# Altium project PCB-Tester-Board-V1.PrjPcb (part 2 of 3)

## Sheet PSU2.SchDoc: PCB-Tester PSU2
size A3; Date: JUN 2020; CheckedBy: Moerz, Hoeren; Author: Rudziński; CompanyName: TDK-Micronas GmbH; DrawnBy: Rudziński; Engineer: Rudziński; Organization: Test Engineering; Address1: Hans-Bunte-Strasse 19; Address2: D-79108 Freiburg; Address3: Germany; DocumentNumber: U33110; Revision: V1.0; SheetNumber: 16; SheetTotal: 20; DateDraw: JUN 2020; DateChecked: 2020-06-19; PageSetup: Record=PageOptions|CenterHorizontal=True|CenterVertical=True|PrintScale=0.97|XCorrection=1.00|YCorrection=1.00|PrintKind=0|BorderSize=5000000|LeftOffset=0|BottomOffset=0|Orientation=2|PaperLength=1000|PaperWidth=1000|Scale=100|PaperSource=7|PrintQuality=-3|MediaType=1|DitherType=10|PrintScaleMode=1|PaperKind=A4|PaperIndex=9; TitleTyp: Title-Typ; Block: CPU & SCT8; Workspace: Workspace
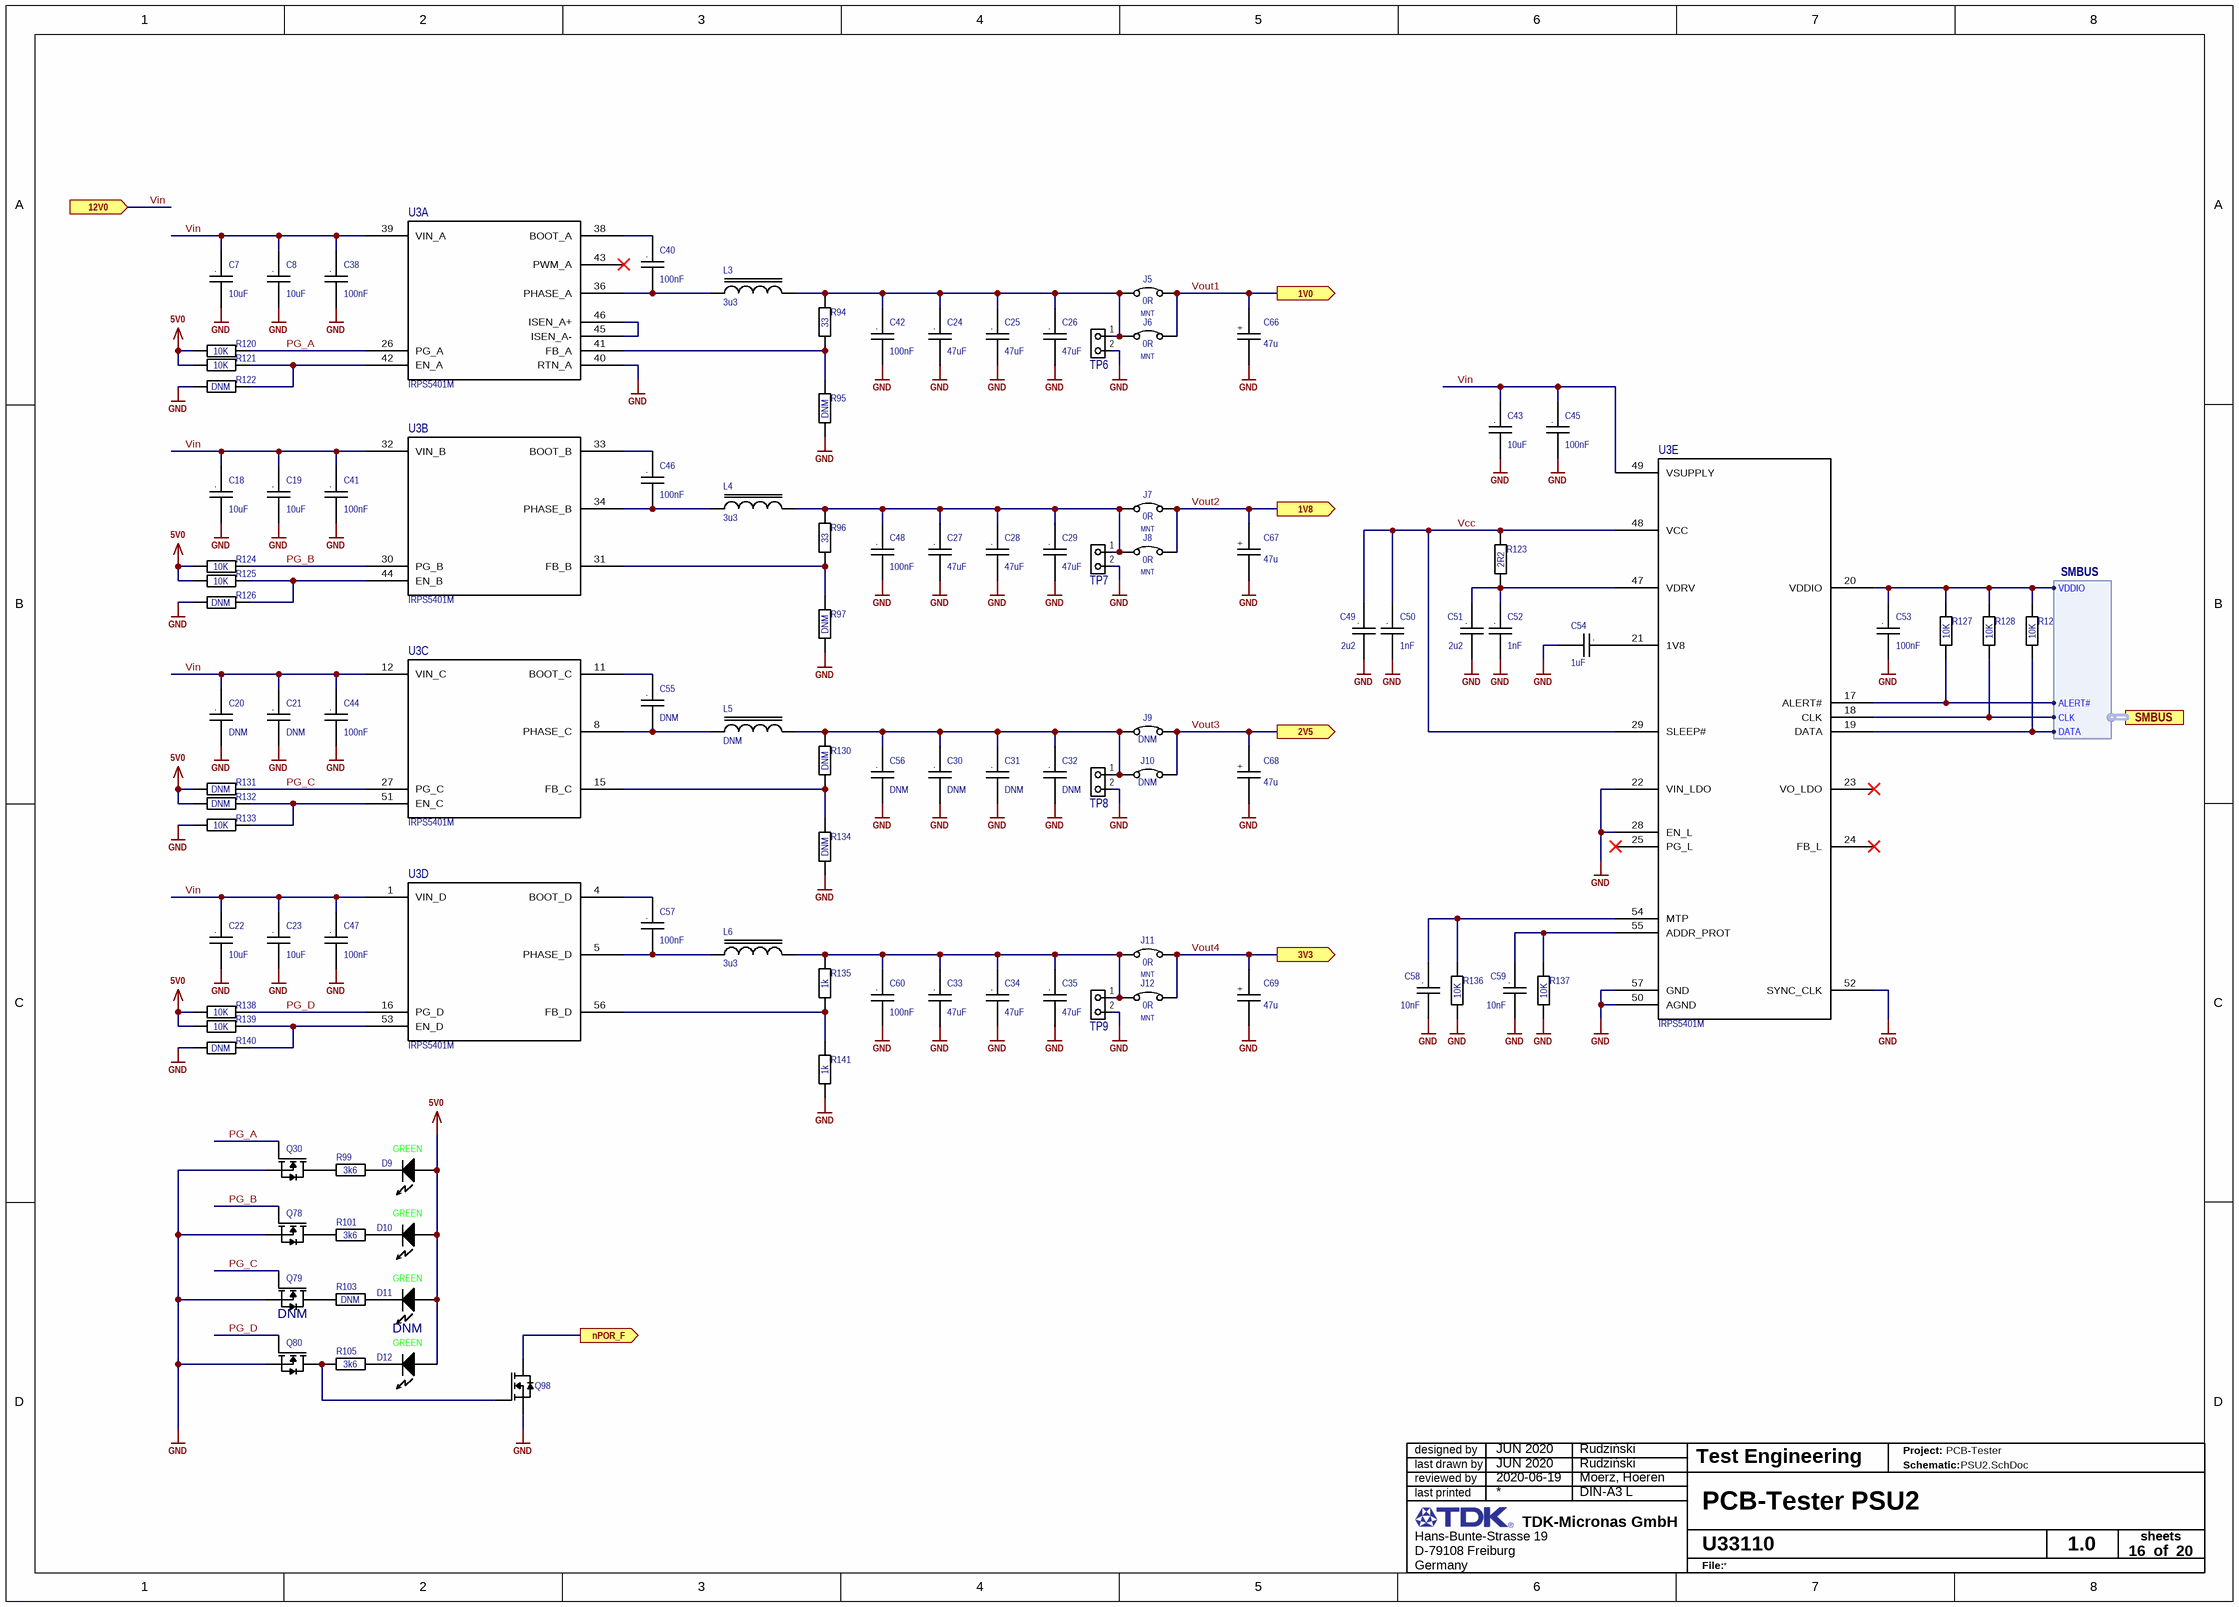
[diagram p3: PSU2.SchDoc]

### Parts
C7  value 10uF  [C1206 Reflow]  (hidden comment: C)
C8  value 10uF  [C1206 Reflow]  (hidden comment: C)
C18  value 10uF  [C1206 Reflow]  (hidden comment: C)
C19  value 10uF  [C1206 Reflow]  (hidden comment: C)
C20  value DNM  [C1206 Reflow]  (hidden comment: C)  (no BOM)
C21  value DNM  [C1206 Reflow]  (hidden comment: C)  (no BOM)
C22  value 10uF  [C1206 Reflow]  (hidden comment: C)
C23  value 10uF  [C1206 Reflow]  (hidden comment: C)
C24  value 47uF  [C1210 Reflow]  (hidden comment: C)
C25  value 47uF  [C1210 Reflow]  (hidden comment: C)
C26  value 47uF  [C1210 Reflow]  (hidden comment: C)
C27  value 47uF  [C1210 Reflow]  (hidden comment: C)
C28  value 47uF  [C1210 Reflow]  (hidden comment: C)
C29  value 47uF  [C1210 Reflow]  (hidden comment: C)
C30  value DNM  [C1210 Reflow]  (hidden comment: C)  (no BOM)
C31  value DNM  [C1210 Reflow]  (hidden comment: C)  (no BOM)
C32  value DNM  [C1210 Reflow]  (hidden comment: C)  (no BOM)
C33  value 47uF  [C1210 Reflow]  (hidden comment: C)
C34  value 47uF  [C1210 Reflow]  (hidden comment: C)
C35  value 47uF  [C1210 Reflow]  (hidden comment: C)
C38  value 100nF  [C0402 Reflow]  (hidden comment: C)
C40  value 100nF  [C0402 Reflow]  (hidden comment: C)
C41  value 100nF  [C0402 Reflow]  (hidden comment: C)
C42  value 100nF  [C0402 Reflow]  (hidden comment: C)
C43  value 10uF  [C1206 Reflow]  (hidden comment: C)
C44  value 100nF  [C0402 Reflow]  (hidden comment: C)
C45  value 100nF  [C0402 Reflow]  (hidden comment: C)
C46  value 100nF  [C0402 Reflow]  (hidden comment: C)
C47  value 100nF  [C0402 Reflow]  (hidden comment: C)
C48  value 100nF  [C0402 Reflow]  (hidden comment: C)
C49  value 2u2  [C0805 Reflow]  (hidden comment: C)
C50  value 1nF  [C0402 Reflow]  (hidden comment: C)
C51  value 2u2  [C0805 Reflow]  (hidden comment: C)
C52  value 1nF  [C0402 Reflow]  (hidden comment: C)
C53  value 100nF  [C0402 Reflow]  (hidden comment: C)
C54  value 1uF  [C0402 Reflow]  (hidden comment: C)
C55  value DNM  [C0402 Reflow]  (hidden comment: C)  (no BOM)
C56  value DNM  [C0402 Reflow]  (hidden comment: C)  (no BOM)
C57  value 100nF  [C0402 Reflow]  (hidden comment: C)
C58  value 10nF  [C0402 Reflow]  (hidden comment: C)
C59  value 10nF  [C0402 Reflow]  (hidden comment: C)
C60  value 100nF  [C0402 Reflow]  (hidden comment: C)
C66  value 47u  [CAP_TAN_B]  (hidden comment: C+)
C67  value 47u  [CAP_TAN_B]  (hidden comment: C+)
C68  value 47u  [CAP_TAN_B]  (hidden comment: C+)
C69  value 47u  [CAP_TAN_B]  (hidden comment: C+)
D9  Color: GREEN  [L0603G]  (hidden comment: D)
D10  Color: GREEN  [L0603G]  (hidden comment: D)
D11  Color: GREEN  NicName: DNM  [L0603G]  (hidden comment: D)  (no BOM)
D12  Color: GREEN  [L0603G]  (hidden comment: D)
J5  value 0R  POPULATED: MNT  [JumperSMD]  (hidden comment: J)  (no BOM)
J6  value 0R  POPULATED: MNT  [JumperSMD]  (hidden comment: J)  (no BOM)
J7  value 0R  POPULATED: MNT  [JumperSMD]  (hidden comment: J)  (no BOM)
J8  value 0R  POPULATED: MNT  [JumperSMD]  (hidden comment: J)  (no BOM)
J9  value DNM  [JumperSMD]  (hidden comment: J)  (no BOM)
J10  value DNM  [JumperSMD]  (hidden comment: J)  (no BOM)
J11  value 0R  POPULATED: MNT  [JumperSMD]  (hidden comment: J)  (no BOM)
J12  value 0R  POPULATED: MNT  [JumperSMD]  (hidden comment: J)  (no BOM)
L3  Inductance: 3u3  [XAL7070]  (hidden comment: L)
L4  Inductance: 3u3  [XAL7070]  (hidden comment: L)
L5  Inductance: DNM  [XAL7070]  (hidden comment: L)  (no BOM)
L6  Inductance: 3u3  [XAL7070]  (hidden comment: L)
Q30  Q  [SOT23-3]  (value not drawn)
Q78  Q  [SOT23-3]  (value not drawn)
Q79  NicName: DNM  [SOT23-3]  (hidden comment: Q)  (no BOM)
Q80  Q  [SOT23-3]  (value not drawn)
Q98  Q  [SOT23-3]  (value not drawn)
R94  value 33  [R0402 Reflow]  (hidden comment: R)
R95  value DNM  [R0402 Reflow]  (hidden comment: R)  (no BOM)
R96  value 33  [R0402 Reflow]  (hidden comment: R)
R97  value DNM  [R0402 Reflow]  (hidden comment: R)  (no BOM)
R99  value 3k6  [R0603 Reflow]  (hidden comment: R)
R101  value 3k6  [R0603 Reflow]  (hidden comment: R)
R103  value DNM  [R0603 Reflow]  (hidden comment: R)  (no BOM)
R105  value 3k6  [R0603 Reflow]  (hidden comment: R)
R120  value 10K  [R0402 Reflow]  (hidden comment: R)
R121  value 10K  [R0402 Reflow]  (hidden comment: R)
R122  value DNM  [R0402 Reflow]  (hidden comment: R)  (no BOM)
R123  value 2R2  [R0402 Reflow]  (hidden comment: R)
R124  value 10K  [R0402 Reflow]  (hidden comment: R)
R125  value 10K  [R0402 Reflow]  (hidden comment: R)
R126  value DNM  [R0402 Reflow]  (hidden comment: R)  (no BOM)
R127  value 10K  [R0402 Reflow]  (hidden comment: R)
R128  value 10K  [R0402 Reflow]  (hidden comment: R)
R129  value 10K  [R0402 Reflow]  (hidden comment: R)
R130  value DNM  [R0402 Reflow]  (hidden comment: R)  (no BOM)
R131  value DNM  [R0402 Reflow]  (hidden comment: R)  (no BOM)
R132  value DNM  [R0402 Reflow]  (hidden comment: R)  (no BOM)
R133  value 10K  [R0402 Reflow]  (hidden comment: R)
R134  value DNM  [R0402 Reflow]  (hidden comment: R)  (no BOM)
R135  value 1k  [R0402 Reflow]  (hidden comment: R)
R136  value 10K  [R0402 Reflow]  (hidden comment: R)
R137  value 10K  [R0402 Reflow]  (hidden comment: R)
R138  value 10K  [R0402 Reflow]  (hidden comment: R)
R139  value 10K  [R0402 Reflow]  (hidden comment: R)
R140  value DNM  [R0402 Reflow]  (hidden comment: R)  (no BOM)
R141  value 1k  [R0402 Reflow]  (hidden comment: R)
TP6  TP  [DualTestpoint 100mils]  (value not drawn)  (no BOM)
TP7  TP  [DualTestpoint 100mils]  (value not drawn)  (no BOM)
TP8  TP  [DualTestpoint 100mils]  (value not drawn)  (no BOM)
TP9  TP  [DualTestpoint 100mils]  (value not drawn)  (no BOM)
U3  IRPS5401M  [QFN4-7x7-56_IRPS5401M]  (parts A,B,C,D,E of 5)

### Ports
1V0 (out), 1V8 (out), 2V5 (out), 3V3 (out), 12V0 (in), nPOR_F (out), SMBUS (harness SMBUS)

### Harnesses
SMBUS: ALERT#, CLK, DATA, VDDIO

### Nets
5V0: D9.1(Anode) D10.1(Anode) D11.1(Anode) D12.1(Anode) R120.2 R121.2 R124.2 R125.2 R131.2 R132.2 R138.2 R139.2
GND: C7.2 C8.2 C18.2 C19.2 C20.2 C21.2 C22.2 C23.2 C24.2 C25.2 C26.2 C27.2 C28.2 C29.2 C30.2 C31.2 C32.2 C33.2 C34.2 C35.2 C38.2 C41.2 C42.2 C43.2 C44.2 C45.2 C47.2 C48.2 C49.2 C50.2 C51.2 C52.2 C53.2 C54.2 C56.2 C58.2 C59.2 C60.2 C66.2 C67.2 C68.2 C69.2 Q30.2(S) Q78.2(S) Q79.2(S) Q80.2(S) Q98.2(S) R95.1 R97.1 R122.2 R126.2 R133.2 R134.1 R136.1 R137.1 R140.2 R141.1 TP6.2 TP7.2 TP8.2 TP9.2 U3.22(VIN_LDO) U3.28(EN_L) U3.40(RTN_A) U3.50(AGND) U3.52(SYNC_CLK) U3.57(GND)
nPOR_F: Q98.3(D) ; port nPOR_F
PG_A: Q30.1(G) R120.1 U3.26(PG_A)  [project net PG_A_16]
PG_B: Q78.1(G) R124.1 U3.30(PG_B)  [project net PG_B_16]
PG_C: Q79.1(G) R131.1 U3.27(PG_C)  [project net PG_C_16]
PG_D: Q80.1(G) R138.1 U3.16(PG_D)  [project net PG_D_16]
Vcc: C49.1 C50.1 R123.2 U3.29(SLEEP#) U3.48(VCC)  [project net Vcc_16]
Vin: C7.1 C8.1 C18.1 C19.1 C20.1 C21.1 C22.1 C23.1 C38.1 C41.1 C43.1 C44.1 C45.1 C47.1 U3.1(VIN_D) U3.12(VIN_C) U3.32(VIN_B) U3.39(VIN_A) U3.49(VSUPPLY) ; port 12V0
Vout1: C66.1 J5.2 J6.2 ; port 1V0
Vout2: C67.1 J7.2 J8.2 ; port 1V8
Vout3: C68.1 J9.2 J10.2 ; port 2V5
Vout4: C69.1 J11.2 J12.2 ; port 3V3
NetC24_1: C24.1 C25.1 C26.1 C42.1 J5.1 J6.1 L3.2 R94.2 TP6.1
NetC27_1: C27.1 C28.1 C29.1 C48.1 J7.1 J8.1 L4.2 R96.2 TP7.1
NetC30_1: C30.1 C31.1 C32.1 C56.1 J9.1 J10.1 L5.2 R130.2 TP8.1
NetC33_1: C33.1 C34.1 C35.1 C60.1 J11.1 J12.1 L6.2 R135.2 TP9.1
NetC40_1: C40.1 U3.38(BOOT_A)
NetC40_2: C40.2 L3.1 U3.36(PHASE_A)
NetC46_1: C46.1 U3.33(BOOT_B)
NetC46_2: C46.2 L4.1 U3.34(PHASE_B)
NetC51_1: C51.1 C52.1 R123.1 U3.47(VDRV)
NetC53_1: C53.1 R127.2 R128.2 R129.2 U3.20(VDDIO) ; port SMBUS.VDDIO
NetC54_1: C54.1 U3.21(1V8)
NetC55_1: C55.1 U3.11(BOOT_C)
NetC55_2: C55.2 L5.1 U3.8(PHASE_C)
NetC57_1: C57.1 U3.4(BOOT_D)
NetC57_2: C57.2 L6.1 U3.5(PHASE_D)
NetC58_1: C58.1 R136.2 U3.54(MTP)
NetC59_1: C59.1 R137.2 U3.55(ADDR_PROT)
NetD9_2: D9.2(Cathode) R99.2
NetD10_2: D10.2(Cathode) R101.2
NetD11_2: D11.2(Cathode) R103.2
NetD12_2: D12.2(Cathode) R105.2
NetQ30_3: Q30.3(D) R99.1
NetQ78_3: Q78.3(D) R101.1
NetQ79_3: Q79.3(D) R103.1
NetQ80_3: Q80.3(D) Q98.1(G) R105.1
NetR94_1: R94.1 R95.2 U3.41(FB_A)
NetR96_1: R96.1 R97.2 U3.31(FB_B)
NetR121_1: R121.1 R122.1 U3.42(EN_A)
NetR125_1: R125.1 R126.1 U3.44(EN_B)
NetR127_1: R127.1 U3.17(ALERT#) ; port SMBUS.ALERT#
NetR128_1: R128.1 U3.18(CLK) ; port SMBUS.CLK
NetR129_1: R129.1 U3.19(DATA) ; port SMBUS.DATA
NetR130_1: R130.1 R134.2 U3.15(FB_C)
NetR132_1: R132.1 R133.1 U3.51(EN_C)
NetR135_1: R135.1 R141.2 U3.56(FB_D)
NetR139_1: R139.1 R140.1 U3.53(EN_D)
NetU3_45: U3.45(ISEN_A-) U3.46(ISEN_A+)

Not connected (* = marked no-connect by the designer): U3 23(VO_LDO)* 24(FB_L)* 25(PG_L)* 43(PWM_A)*

### Notes on the sheet
- designed by
- reviewed by
- last drawn by
- Project:
- Schematic:
- last printed
- DIN-A3 L
- sheets
- of
- File:
- (in symbol C) .
- (in symbol C+_TAN) +
- (in symbol C_2) .
- (in symbol C_7) .
- (in symbol C_10) .
- (in symbol C_11) .

### Library data of the parts
C7 C8 C18-C23 C43 = C: CAP CER 10UF 25V X7R 1206; 04. Manufacturer: TDK Corporation; 07. Manufacturer  Part Number: C3216X7R1E106K160AB; Tolerance: ±10%; 03. Unit Price: 0.66; 13. Created Date/Name: AUG2018/Hören; Voltage Rating: 25V; Type: X7R; ComponentLink1Description: Info; ComponentLink1URL: https://www.digikey.de/products/en?keywords=445-7705-6-ND; 02. Distributor Part Number: 445-7705-6-ND; 09. Operating Temperature: -55°C ~ 125°C; 11. RoHS: YES; 01. Distributor: DigiKey; ComponentLink2Description: DataSheet; Package: 1206
C24-C35 = C: CAP CER 47UF 10V X5R 1210; 04. Manufacturer: Samsung Electro-Mechanics; 07. Manufacturer  Part Number: CL32A476MPJNNNE; Tolerance: ±20%; 03. Unit Price: 0.88; 13. Created Date/Name: AUG2018/Hören; Voltage Rating: 10V; Type: X5R; ComponentLink1Description: Info; ComponentLink1URL: *; 02. Distributor Part Number: 1276-3380-6-ND; 09. Operating Temperature: -55°C ~ 85°C; 11. RoHS: YES; 01. Distributor: DigiKey; ComponentLink2Description: DataSheet; Package: 1210
C38 C40-C42 C44-C48 C53 C55-C57 C60 = C: CAP CER 0.1UF 25V X7R 0402; 04. Manufacturer: Yageo; 07. Manufacturer  Part Number: CC0402KRX7R8BB104; Tolerance: ±10%; 03. Unit Price: 0.09; 13. Created Date/Name: AUG2018/Hören; Voltage Rating: 25V; Type: X7R; ComponentLink1Description: Info; ComponentLink1URL: https://www.digikey.de/products/en?keywords=311-2077-6-ND; 02. Distributor Part Number: 311-2077-6-ND; 09. Operating Temperature: -55°C ~ 125°C; 11. RoHS: YES; 01. Distributor: DigiKey; ComponentLink2Description: DataSheet; Package: 0402
C49 C51 = C_11: CAP CER 2.2UF 10V X7R 0805; 04. Manufacturer: Samsung Electro-Mechanics; 07. Manufacturer  Part Number: CL21B225KPFNNNE; 03. Unit Price: 0.11; Voltage Rating: 10V; Type: X7R; ComponentLink1Description: Info; ComponentLink1URL: https://www.digikey.de/products/en?keywords=311-2077-6-ND; 02. Distributor Part Number: 1276-1188-1-ND; 11. RoHS: YES; 01. Distributor: DigiKey; ComponentLink2Description: DataSheet; Package: 0805
C50 C52 = C_7: CAP CER 1000PF 25V X7R 0402; 04. Manufacturer: KEMET; 07. Manufacturer  Part Number: C0402C102K3RACTU; Tolerance: ±10%; 03. Unit Price: 0.09; 13. Created Date/Name: AUG2018/Hören; Voltage Rating: 25V; Type: X7R; ComponentLink1Description: Info; ComponentLink1URL: https://www.digikey.de/products/en?keywords=399-1031-6-ND; 02. Distributor Part Number: 399-1031-6-ND; 09. Operating Temperature: -55°C ~ 125°C; 11. RoHS: YES; 01. Distributor: DigiKey; ComponentLink2Description: DataSheet; Package: 0402
C54 = C_2: CAP CER 1UF 6.3V X7R 0402; 04. Manufacturer: Murata Electronics; 07. Manufacturer  Part Number: GRM155R70J105KA12J; Tolerance: ±10%; 03. Unit Price: 0.11; 13. Created Date/Name: AUG2018/Hören; Voltage Rating: 6.3V; Type: X7R; ComponentLink1Description: Info; ComponentLink1URL: https://www.digikey.de/product-detail/en/murata-electronics/GRM155R70J105KA12J/490-13339-6-ND/5973468; 02. Distributor Part Number: 490-13339-6-ND; 09. Operating Temperature: -55°C ~ 125°C; 11. RoHS: YES; 01. Distributor: DigiKey; ComponentLink2Description: DataSheet; Package: 0402
C58 C59 = C_10: CAP CER 0.01UF 25V X7R 0402; 04. Manufacturer: Murata Electronics; 07. Manufacturer  Part Number: GCM155R71E103KA37D; Tolerance: ±10%; 03. Unit Price: 0.09; Voltage Rating: 25V; Type: X7R; ComponentLink1Description: Info; 02. Distributor Part Number: 490-6043-1-ND; 09. Operating Temperature: -55°C ~ 125°C; 11. RoHS: YES; 01. Distributor: DigiKey; ComponentLink2Description: DataSheet; ComponentLink2URL: https://www.murata.com/~/media/webrenewal/support/library/catalog/products/capacitor/mlcc/c03e.ashx?la=en-us; Package: 0402
  C58: ComponentLink1URL: https://www.digikey.de/products/en?keywords=311-2077-6-ND
  C59: ComponentLink1URL: https://www.digikey.de/product-detail/en/murata-electronics/GCM155R71E103KA37D/490-6043-1-ND/3845243
C66-C69 = C+_TAN: CAP TANT 47UF 20% 10V 1411; 04. Manufacturer: AVX Corporation; 07. Manufacturer  Part Number: F971A476MBAHT3; 03. Unit Price: 0.73; 3D-Export: No; ComponentLink1Description: Info; 02. Distributor Part Number: 478-12531-1-ND; 11. RoHS: YES; 01. Distributor: DigiKey; ComponentLink2Description: DataSheet
D9-D12 = LED: LED GREEN DIFFUSED 0603 SMD; 04. Manufacturer: OSRAM Opto Semiconductors Inc.; 07. Manufacturer  Part Number: LG L29K-G2J1-24-Z; Vf: 1.7V; If: 2mA; Wave Length: 570nm; Viewing Angle: 160°; 03. Unit Price: 0.4; 13. Created Date/Name: AUG2018/Hören; ComponentLink1Description: Info; ComponentLink1URL: https://www.digikey.de/products/en?keywords=475-2709-6-ND; ComponentLink2Description: DataSheet; ComponentLink2URL: https://www.digikey.de/products/en?keywords=475-2709-6-ND; 02. Distributor Part Number: 475-2709-6-ND; 11. RoHS: YES; 01. Distributor: DigiKey
J5-J12 = Jumper SMD: RES SMD 0 OHM JUMPER 1/10W 0603; 04. Manufacturer: Yageo; 07. Manufacturer  Part Number: RC0603JR-070RL; 03. Unit Price: 0.09; 01. Distributor: DigiKey; 02. Distributor Part Number: 311-0.0GRDKR-ND; 09. Operating Temperature: -55°C ~ 155°C; 11. RoHS: YES; Package: 0603; ComponentLink4Description: Info; ComponentLink4URL: https://www.digikey.de/product-detail/en/yageo/RC0603JR-070RL/311-0.0GRDKR-ND/732569; ComponentLink5Description: DataSheet; ComponentLink5URL: http://www.yageo.com/documents/recent/PYu-RC_Group_51_RoHS_L_10.pdf
L3-L6 = INDUCTOR: Fixed Inductors 3.3uH Shld 20% 15.1A 9.42mOhms AECQ2; 04. Manufacturer: Coilcraft; 07. Manufacturer  Part Number: XAL7070-332MEC; Impedance Tolerance: %; 03. Unit Price: 3.05; ComponentLink1Description: Info; ComponentLink1URL: https://www.digikey.de/products/en?keywords=732-1620-6-ND; ComponentLink2Description: DataSheet; ComponentLink2URL: https://www.we-online.de/katalog/datasheet/742792040.pdf; 02. Distributor Part Number: 994-XAL7070-332MEC; 11. RoHS: YES; Tolerance: *; Value: *; 01. Distributor: Mouser
Q30 Q78-Q80 Q98 = FDV303N: MOSFET N-CH 25V 680MA SOT-23; 04. Manufacturer: ON Semiconductor; 03. Unit Price: 0.41; 13. Created Date/Name: AUG 2018 / Hören; Rds On: 450 mΩ @ id=500mA & Vgs=4.5V; Vgs,th: 1.5V @ 250uA; Power Rating: 350mW; 3D-Export: No; 01. Distributor: DigiKey; 02. Distributor Part Number: FDV303NDKR-ND; 07. Manufacturer  Part Number: FDV303N; 09. Operating Temperature: -55°C ~ 150°C (TJ); 11. RoHS: YES; ComponentLink1Description: Info; ComponentLink1URL: https://www.digikey.de/product-detail/en/on-semiconductor/FDV303N/FDV303NDKR-ND/1630434; ComponentLink2Description: DataSheet; ComponentLink2URL: https://media.digikey.com/pdf/Data%20Sheets/Fairchild%20PDFs/FDV303N.pdf; Vdss: 25V; Id: 680mA
R94 R96 = R: RES SMD 33 OHM 1% 1/16W 0402; 04. Manufacturer: Yageo; 07. Manufacturer  Part Number: RC0402FR-0733RL; 03. Unit Price: 0.09; 13. Created Date/Name: AUG2018/Hören; Power Rating: 63mW; Tolerance: ±1%; ComponentLink1URL: https://www.digikey.de/products/en?keywords=311-10.0KLRDKR-ND; ComponentLink1Description: Info; 02. Distributor Part Number: 311-33.0LRDKR-ND; 09. Operating Temperature: -55°C ~ 155°C; 11. RoHS: YES; 01. Distributor: DigiKey; ComponentLink2Description: DataSheet; Type: Thick Film; Package: 0402
R95 R97 R120-R122 R124-R134 R136-R140 = R: RES SMD 10K OHM 1% 1/16W 0402; 04. Manufacturer: Yageo; 07. Manufacturer  Part Number: RC0402FR-0710KL; 03. Unit Price: 0.09; 13. Created Date/Name: AUG2018/Hören; Power Rating: 63mW; Tolerance: ±1%; ComponentLink1URL: https://www.digikey.de/products/en?keywords=311-10.0KLRDKR-ND; ComponentLink1Description: Info; 02. Distributor Part Number: 311-10.0KLRDKR-ND; 09. Operating Temperature: -55°C ~ 155°C; 11. RoHS: YES; 01. Distributor: DigiKey; ComponentLink2Description: DataSheet; Type: Thick Film; Package: 0402
R99 R101 R105 = R: RES SMD 3.6K OHM 1% 1/10W 0603; 04. Manufacturer: Yageo; 07. Manufacturer  Part Number: RC0603FR-073K6L; 03. Unit Price: 0.09; 13. Created Date/Name: AUG2018/Hören; Power Rating: 63mW; Tolerance: ±1%; ComponentLink1URL: https://www.digikey.de/product-detail/en/yageo/RC0402FR-071K65L/YAG3043DKR-ND/5282914; ComponentLink1Description: Info; 02. Distributor Part Number: 311-3.60KHRCT-ND; 09. Operating Temperature: -55°C ~ 155°C; 11. RoHS: YES; 01. Distributor: DigiKey; ComponentLink2Description: DataSheet; Type: Thick Film; Package: 0402
R103 = R: RES SMD 1.65K OHM 1% 1/16W 0402; 04. Manufacturer: Yageo; 07. Manufacturer  Part Number: RC0402FR-071K65L; 03. Unit Price: 0.09; 13. Created Date/Name: AUG2018/Hören; Power Rating: 63mW; Tolerance: ±1%; ComponentLink1URL: https://www.digikey.de/product-detail/en/yageo/RC0402FR-071K65L/YAG3043DKR-ND/5282914; ComponentLink1Description: Info; 02. Distributor Part Number: YAG3043DKR-ND; 09. Operating Temperature: -55°C ~ 155°C; 11. RoHS: YES; 01. Distributor: DigiKey; ComponentLink2Description: DataSheet; Type: Thick Film; Package: 0402
R123 = R_24: RES SMD 2.2 OHM 1% 1/16W 0402; 04. Manufacturer: Yageo; 07. Manufacturer  Part Number: RC0402FR-072R2L; 03. Unit Price: 0.09; Power Rating: 0.1W; Tolerance: ±1%; ComponentLink1URL: https://www.digikey.de/product-detail/en/panasonic-electronic-components/ERJ-2RKF15R0X/P15.0LDKR-ND/575530; ComponentLink1Description: Info; 02. Distributor Part Number: 311-2.20LRTR-ND; 11. RoHS: YES; ComponentLink2Description: DataSheet; ComponentLink2URL: https://industrial.panasonic.com/cdbs/www-data/pdf/RDA0000/AOA0000C304.pdf; Package: 0402
R135 R141 = R: RES SMD 1K OHM 1% 1/16W 0402; 04. Manufacturer: Yageo; 07. Manufacturer  Part Number: RC0402FR-071KP; 03. Unit Price: 0.09; 13. Created Date/Name: AUG2018/Hören; Power Rating: 63mW; Tolerance: ±1%; ComponentLink1URL: https://www.digikey.de/products/en?keywords=311-10.0KLRDKR-ND; ComponentLink1Description: Info; 02. Distributor Part Number: YAG1254CT-ND; 09. Operating Temperature: -55°C ~ 155°C; 11. RoHS: YES; 01. Distributor: DigiKey; ComponentLink2Description: DataSheet; Type: Thick Film; Package: 0402
TP6-TP9 = DualTestpoint 100mils: Dual testpoint, pitch 2.54mm; 04. Manufacturer: Samtec Inc.; 07. Manufacturer  Part Number: HMTSW-103-07-G-S-240; 03. Unit Price: 0.25; 13. Created Date/Name: AUG2018/Hören; 01. Distributor: Samtec Inc.; 02. Distributor Part Number: HMTSW-103-07-G-S-240; 11. RoHS: YES; ComponentLink1Description: Info; ComponentLink1URL: https://www.samtec.com/products/hmtsw-103-07-g-s-240; ComponentLink2Description: DataSheet; ComponentLink2URL: http://suddendocs.samtec.com/catalog_english/hmtsw.pdf
U3 = IRPS5401M: POL - SUPIRBUCK; MFR-PN: IRPS5401MTRPBF; MFR: Infineon; 04. Manufacturer: Infineon Technologies; 03. Unit Price: 6.99; 07. Manufacturer  Part Number: IRPS5401MTRPBF; 01. Distributor: DigiKey; 02. Distributor Part Number: IRPS5401MTRPBFCT-ND; 11. RoHS: YES; ComponentLink4Description: Info; ComponentLink4URL: https://www.digikey.de/products/en?keywords=XC7A15T-1CSG324C; ComponentLink5Description: DataSheet; ComponentLink5URL: https://www.xilinx.com/support/documentation/data_sheets/ds181_Artix_7_Data_Sheet.pdf; ComponentLink6Description: NXP; ComponentLink6URL: https://www.nxp.com/part/MK20DN512VMD10; NicName: IRPS5401M

## Sheet PSU3.SchDoc: PCB-Tester PSU3
size A4; Date: JUN 2020; CheckedBy: Moerz, Hoeren; Author: Rudziński; CompanyName: TDK-Micronas GmbH; DrawnBy: Rudziński; Engineer: Rudziński; Organization: Test Engineering; Address1: Hans-Bunte-Strasse 19; Address2: D-79108 Freiburg; Address3: Germany; DocumentNumber: U33110; Revision: V1.0; SheetNumber: 17; SheetTotal: 20; DateDraw: JUN 2020; DateChecked: 2020-06-19; Workspace: Workspace; TitleTyp: Title-Typ; PageSetup: Record=PageOptions|CenterHorizontal=True|CenterVertical=True|PrintScale=0.97|XCorrection=1.00|YCorrection=1.00|PrintKind=0|BorderSize=5000000|LeftOffset=0|BottomOffset=0|Orientation=2|PaperLength=1000|PaperWidth=1000|Scale=100|PaperSource=7|PrintQuality=-3|MediaType=1|DitherType=10|PrintScaleMode=1|PaperKind=A4|PaperIndex=9
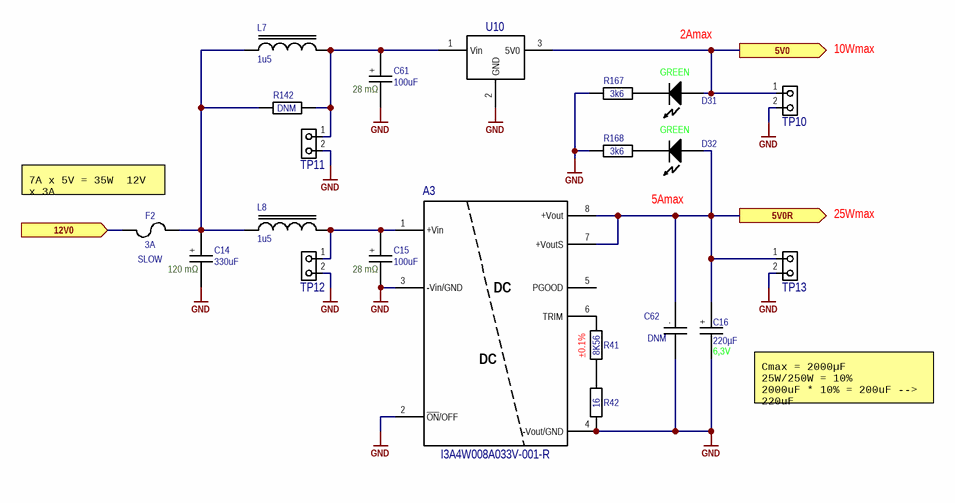
[diagram p4: PSU3.SchDoc]

### Parts
A3  A  [I3A-POSETIVE]  (value not drawn)
C14  value 330uF  ESR: 120 mΩ  [SMD-CAP-ALU-G]  (hidden comment: C+)
C15  value 100uF  ESR: 28 mΩ  [SMD-CAP-ALU-G]  (hidden comment: C+)
C16  value 220µF  Voltage Rating: 6,3V  [SMD-CAP-ALU-E]  (hidden comment: C+)
C61  value 100uF  ESR: 28 mΩ  [SMD-CAP-ALU-G]  (hidden comment: C+)
C62  value DNM  [C0402 Reflow]  (hidden comment: C)  (no BOM)
D31  Color: GREEN  [L0603G]  (hidden comment: D)
D32  Color: GREEN  [L0603G]  (hidden comment: D)
F2  value 3A  Speed: SLOW  [OMNI-Fuse]  (hidden comment: F)
L7  Inductance: 1u5  [XAL4020]  (hidden comment: L)
L8  Inductance: 1u5  [XAL4020]  (hidden comment: L)
R41  value 8K56  Tolerance: ±0.1%  [R0603 Reflow]  (hidden comment: R)
R42  value 16  [R0603 Reflow]  (hidden comment: R)
R142  value DNM  [R1206 Reflow]  (hidden comment: R)  (no BOM)
R167  value 3k6  [R0603 Reflow]  (hidden comment: R)
R168  value 3k6  [R0603 Reflow]  (hidden comment: R)
TP10  TP  [DualTestpoint 100mils]  (value not drawn)  (no BOM)
TP11  TP  [DualTestpoint 100mils]  (value not drawn)  (no BOM)
TP12  TP  [DualTestpoint 100mils]  (value not drawn)  (no BOM)
TP13  TP  [DualTestpoint 100mils]  (value not drawn)  (no BOM)
U10  U  [3SIP Traco]  (value not drawn)

### Ports
5V0 (out), 5V0R (out), 12V0 (in)

### Nets
GND: A3.2(~{ON}/OFF) A3.3(-Vin/GND) A3.4(-Vout/GND) C14.2 C15.2 C16.2 C61.2 C62.2 R42.1 R167.1 R168.1 TP10.2 TP11.2 TP12.2 TP13.2 U10.2(GND)
5V0: D31.1(Anode) TP10.1 U10.3(5V0) ; port 5V0
5V0R: A3.7(+VoutS) A3.8(+Vout) C16.1 C62.1 D32.1(Anode) TP13.1 ; port 5V0R
12V0: F2.1 ; port 12V0
NetA3_1: A3.1(+Vin) C15.1 L8.1 TP12.1
NetA3_6: A3.6(TRIM) R41.2
NetC14_1: C14.1 F2.2 L7.2 L8.2 R142.1
NetC61_1: C61.1 L7.1 R142.2 TP11.1 U10.1(Vin)
NetD31_2: D31.2(Cathode) R167.2
NetD32_2: D32.2(Cathode) R168.2
NetR41_1: R41.1 R42.2

Not connected (* = marked no-connect by the designer): A3 5(PGOOD)

### Notes on the sheet
- 2Amax
- 10Wmax
- (near F2) 7A x 5V = 35W  12V x 3A
- 5Amax
- 25Wmax
- (near C16) Cmax = 2000µF
  25W/250W = 10%
  2000uF * 10% = 200uF --> 220uF
- designed by
- reviewed by
- last drawn by
- Project:
- Schematic:
- last printed
- DIN-A4 L
- sheets
- of
- File:
- (in symbol C) .
- (in symbol C+) +
- (in symbol i3A4W008A033V-001-R) DC

### Library data of the parts
A3 = i3A4W008A033V-001-R: DC DC CONVERTER 3.3-16.5V; 04. Manufacturer: TDK-Lambda Americas Inc.; 03. Unit Price: 20.58; 13. Created Date/Name: AUG 2018 / Hören; 01. Distributor: DigiKey; 02. Distributor Part Number: 285-2720-ND; 07. Manufacturer  Part Number: I3A4W008A033V-001-R; 11. RoHS: YES; ComponentLink1Description: Info; ComponentLink1URL: https://www.digikey.de/products/en?keywords=I3A4W008A033V-001-R; ComponentLink2Description: DataSheet; ComponentLink2URL: https://www.us.tdk-lambda.com/ftp/specs/i3a_full_datasheet.pdf?ref_disty=digikey; NicName: I3A4W008A033V-001-R
C14 = C+: CAP ALUM 330UF 20% 50V SMD; 04. Manufacturer: Panasonic Electronic Components; 07. Manufacturer  Part Number: EEE-FT1H331AP; 03. Unit Price: 0.96; 13. Created Date/Name: AUG2018/Hören; 3D-Export: No; ComponentLink1Description: Info; ComponentLink1URL: https://www.digikey.de/product-detail/en/panasonic-electronic-components/EEE-FT1H331AP/PCE5026DKR-ND/2652105; Tolerance: ±20%; Voltage Rating: 50V; 02. Distributor Part Number: PCE5026DKR-ND; 09. Operating Temperature: -55°C ~ 105°C; 11. RoHS: YES; 01. Distributor: DigiKey; ComponentLink2Description: DataSheet; ComponentLink2URL: https://industrial.panasonic.com/cdbs/www-data/pdf/RDE0000/ABA0000C1240.pdf
C15 C61 = C+: CAP ALUM POLY HYB 100UF 50V SMD; 04. Manufacturer: Panasonic Electronic Components; 07. Manufacturer  Part Number: EEH-ZA1H101P; Tolerance: ±20%; 03. Unit Price: 2.5; 13. Created Date/Name: AUG2018/Hören; 3D-Export: No; ComponentLink1Description: Info; ComponentLink1URL: https://www.digikey.de/product-detail/en/panasonic-electronic-components/EEH-ZA1H101P/P15442DKR-ND/3088152; Voltage Rating: 50V; 02. Distributor Part Number: P15442DKR-ND; 09. Operating Temperature: -55°C ~ 105°C; 11. RoHS: YES; 01. Distributor: DigiKey; ComponentLink2Description: DataSheet; ComponentLink2URL: https://industrial.panasonic.com/cdbs/www-data/pdf/RDD0000/ABA0000C1221.pdf
C16 = C+: CAP ALUM 220UF 20% 6.3V SMD; 04. Manufacturer: Panasonic Electronic Components; 07. Manufacturer  Part Number: EEE-FC0J221P; ESR: 400 mΩ; Type: Radial, Can - SMD; 03. Unit Price: 0.57; 13. Created Date/Name: AUG2018/Hören; Lifetime @ Temp: 1000 Hrs @ 105°C; 3D-Export: No; ComponentLink1Description: Info; ComponentLink1URL: https://www.digikey.de/product-detail/en/panasonic-electronic-components/EEE-FC0J221P/PCE3985DKR-ND/1806511; Tolerance: ±20%; 02. Distributor Part Number: PCE3985DKR-ND; 09. Operating Temperature: -40°C ~ 105°C; 11. RoHS: YES; 01. Distributor: DigiKey; ComponentLink2Description: DataSheet; ComponentLink2URL: https://industrial.panasonic.com/cdbs/www-data/pdf/RDE0000/ABA0000C1172.pdf; Package: Ø8mm x 6.2mm
C62 = C: CAP CER 0.1UF 16V X7R 0402; 04. Manufacturer: KEMET; 07. Manufacturer  Part Number: C0402C104J4RACTU; Tolerance: ±5%; 03. Unit Price: 0.45; 13. Created Date/Name: AUG2018/Hören; Voltage Rating: 16V; Type: X7R; ComponentLink1Description: Info; ComponentLink1URL: https://www.digikey.de/product-detail/en/kemet/C0402C104J4RACTU/399-7761-6-ND/3472292; 02. Distributor Part Number: 399-7761-6-ND; 09. Operating Temperature: -55°C ~ 125°C; 11. RoHS: YES; 01. Distributor: DigiKey; ComponentLink2Description: DataSheet; ComponentLink2URL: https://content.kemet.com/datasheets/KEM_C1002_X7R_SMD.pdf; Package: 0402
D31 D32 = LED: as D9 on sheet PSU2; ComponentLink1Description: Info; ComponentLink1URL: https://www.digikey.de/products/en?keywords=475-2709-6-ND; ComponentLink2Description: DataSheet; ComponentLink2URL: https://www.digikey.de/products/en?keywords=475-2709-6-ND; 02. Distributor Part Number: 475-2709-6-ND; 11. RoHS: YES; 01. Distributor: DigiKey
F2 = Fuse: FUSE BOARD MNT 3A 125VAC/VDC SMD; 04. Manufacturer: Littelfuse Inc.; 07. Manufacturer  Part Number: 0154003.DRTL; 03. Unit Price: 2.84; 13. Created Date/Name: AUG 2018 / Hören; 3D-Export: No; 01. Distributor: DigiKey; 02. Distributor Part Number: F10747DKR-ND; 09. Operating Temperature: -55°C ~ 125°C; 11. RoHS: YES; ComponentLink1Description: Info; ComponentLink1URL: https://www.digikey.de/product-detail/en/littelfuse-inc/0154003.DRTL/F10747DKR-ND/8109626; ComponentLink2Description: DataSheet; ComponentLink2URL: https://www.littelfuse.com/~/media/electronics/datasheets/fuses/littelfuse_fuse_154_154t_154l_154tl_datasheet.pdf.pdf
L7 L8 = INDUCTOR: Fixed Inductors 1.5uH Shld 20% 7.5A 23.6mOhms AECQ2; 04. Manufacturer: Coilcraft; 07. Manufacturer  Part Number: XAL4020-152MEC; Impedance Tolerance: %; 03. Unit Price: 1.75; ComponentLink1Description: Info; ComponentLink1URL: https://www.digikey.de/products/en?keywords=732-1620-6-ND; ComponentLink2Description: DataSheet; ComponentLink2URL: https://www.we-online.de/katalog/datasheet/742792040.pdf; 02. Distributor Part Number: 994-XAL4020-152MEC; 11. RoHS: YES; Tolerance: *; Value: *; 01. Distributor: Mouser
R41 = R: RES 8.56K OHM 0.1% 1/8W 0603; 04. Manufacturer: Vishay Dale; 07. Manufacturer  Part Number: TNPW06038K56BEEA; 03. Unit Price: 0.56; 13. Created Date/Name: AUG2018/Hören; Power Rating: 125mW; 3D-Export: No; ComponentLink1URL: https://www.digikey.de/products/en/resistors/chip-resistor-surface-mount/52?k=&pkeyword=&sv=0&pv2085=u8.56+kOhms&pv3=370&sf=0&FV=ffe00034%2C1c00f3%2C1f140000&quantity=&ColumnSort=0&page=1&pageSize=25; ComponentLink1Description: Info; 02. Distributor Part Number: 541-4554-6-ND; 09. Operating Temperature: -55°C ~ 155°C; 11. RoHS: YES; 01. Distributor: DigiKey; ComponentLink2Description: DataSheet; ComponentLink2URL: http://www.vishay.com/docs/28758/tnpw_e3.pdf; Type: Thin Film; Package: 0603
R42 = R: RES SMD 16 OHM 1% 1/10W 0603; 04. Manufacturer: Yageo; 07. Manufacturer  Part Number: RC0603FR-0716RL; 03. Unit Price: 0.09; 13. Created Date/Name: AUG2018/Hören; Power Rating: 100mW; 3D-Export: No; Tolerance: ±1%; ComponentLink1URL: https://www.digikey.de/product-detail/en/yageo/RC0603FR-0716RL/311-16.0HRDKR-ND/732858; ComponentLink1Description: Info; 02. Distributor Part Number: 311-16.0HRDKR-ND; 09. Operating Temperature: -55°C ~ 155°C; 11. RoHS: YES; 01. Distributor: DigiKey; ComponentLink2Description: DataSheet; ComponentLink2URL: http://www.yageo.com/documents/recent/PYu-RC_Group_51_RoHS_L_10.pdf; Type: Thick Film; Package: 0603
R142 = R_25: RES SMD 0 OHM JUMPER 1206; ComponentLink1URL: https://www.digikey.de/products/en?keywords=311-0.0JRDKR-ND; ComponentLink1Description: Info; 11. RoHS: YES; ComponentLink2Description: DataSheet; Package: 1206
R167 R168 = R: as R99 on sheet PSU2; Tolerance: ±1%; ComponentLink1URL: https://www.digikey.de/product-detail/en/yageo/RC0402FR-071K65L/YAG3043DKR-ND/5282914; ComponentLink1Description: Info; 02. Distributor Part Number: 311-3.60KHRCT-ND; 09. Operating Temperature: -55°C ~ 155°C; 11. RoHS: YES; 01. Distributor: DigiKey; ComponentLink2Description: DataSheet; Type: Thick Film; Package: 0402
TP10-TP13 = DualTestpoint 100mils: as TP6 on sheet PSU2; 01. Distributor: Samtec Inc.; 02. Distributor Part Number: HMTSW-103-07-G-S-240; 11. RoHS: YES; ComponentLink1Description: Info; ComponentLink1URL: https://www.samtec.com/products/hmtsw-103-07-g-s-240; ComponentLink2Description: DataSheet; ComponentLink2URL: http://suddendocs.samtec.com/catalog_english/hmtsw.pdf
U10 = TSR 2-2450: DC DC CONVERTER 5V 10W; 04. Manufacturer: Traco Power; 03. Unit Price: 11.31; 13. Created Date/Name: AUG 2018 / Hören; 01. Distributor: DigiKey; 02. Distributor Part Number: 1951-2692-ND; 07. Manufacturer  Part Number: TSR 2-2450; 11. RoHS: YES; ComponentLink1Description: Info; ComponentLink1URL: https://www.digikey.de/products/en/power-supplies-board-mount/dc-dc-converters/922?k=TSR2&k=&pkeyword=TSR2&sv=0&pv1525=249171&sf=0&FV=-8%7C922&quantity=&ColumnSort=0&page=1&pageSize=25; ComponentLink2Description: DataSheet; ComponentLink2URL: https://www.tracopower.com/products/tsr2.pdf; Package: 3SIP

## Sheet RelayDriver.SchDoc: PCB-Tester Relay Driver
size A4 portrait; Date: JUN 2020; CheckedBy: Moerz, Hoeren; Author: Rudziński; CompanyName: TDK-Micronas GmbH; DrawnBy: Rudziński; Engineer: Rudziński; Organization: Test Engineering; Address1: Hans-Bunte-Strasse 19; Address2: D-79108 Freiburg; Address3: Germany; DocumentNumber: U33110; Revision: V1.0; SheetNumber: 8; SheetTotal: 20; DateDraw: JUN 2020; DateChecked: 2020-06-19; Workspace: Workspace; TitleTyp: Title-Typ; PageSetup: Record=PageOptions|CenterHorizontal=True|CenterVertical=True|PrintScale=0.97|XCorrection=1.00|YCorrection=1.00|PrintKind=0|BorderSize=5000000|LeftOffset=0|BottomOffset=0|Orientation=2|PaperLength=1000|PaperWidth=1000|Scale=100|PaperSource=7|PrintQuality=-3|MediaType=1|DitherType=10|PrintScaleMode=1|PaperKind=A4|PaperIndex=9
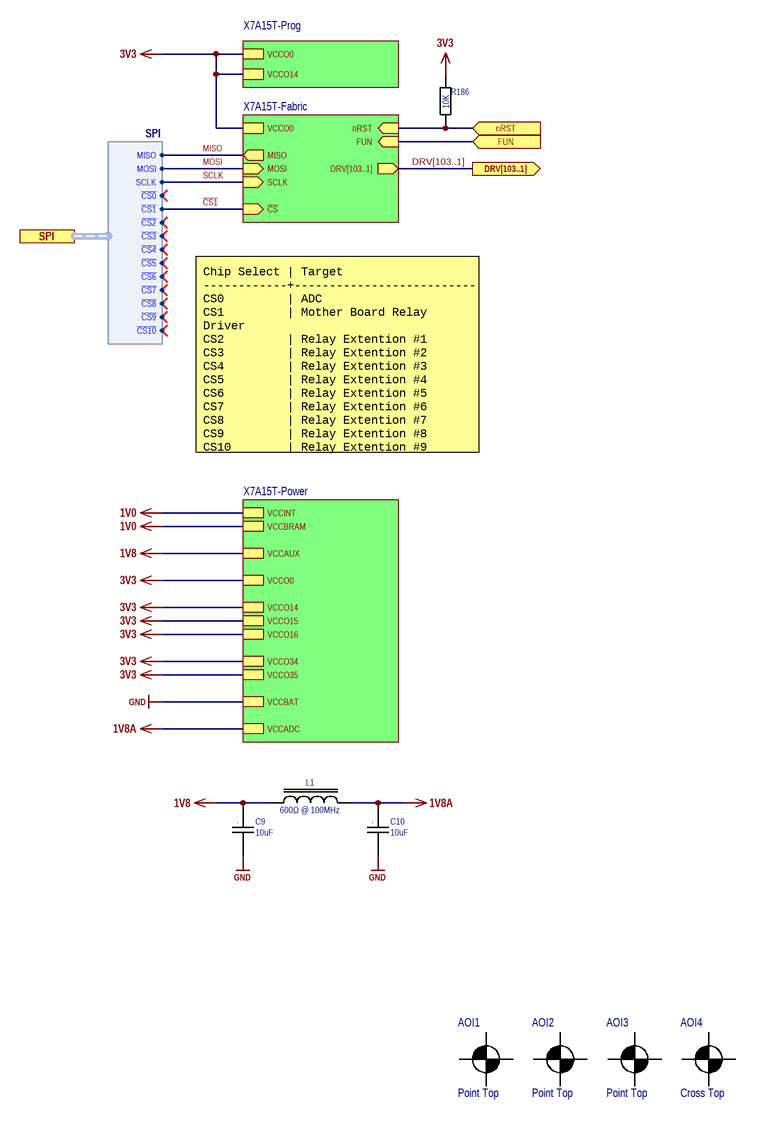
[diagram p5: RelayDriver.SchDoc]

### Parts
AOI1  Shape: Point Top  [Fiducial Point]  (hidden comment: AOI)  (no BOM)
AOI2  Shape: Point Top  [Fiducial Point]  (hidden comment: AOI)  (no BOM)
AOI3  Shape: Point Top  [Fiducial Point]  (hidden comment: AOI)  (no BOM)
AOI4  Shape: Cross Top  [Fiducial Cross]  (hidden comment: AOI)  (no BOM)
C9  value 10uF  [C0805 Reflow]  (hidden comment: C)
C10  value 10uF  [C0805 Reflow]  (hidden comment: C)
L1  Nominal Impedance: 600Ω @ 100MHz  [FB0805]  (hidden comment: L)
R186  value 10K  [R0402 Reflow]  (hidden comment: R)

### Sub-sheets
X7A15T-Fabric = X7A15T-Fabric.SchDoc (file not in this document): SCLK (in), MISO (out), VCCO0, MOSI (in), ~{CS} (in), DRV[103..1] (out), nRST (in), FUN (in)
X7A15T-Power = X7A15T-Power.SchDoc (file not in this document): VCCADC, VCCO0, VCCO14, VCCO35, VCCO16, VCCAUX, VCCINT, VCCO34, VCCBRAM, VCCO15, VCCBAT
X7A15T-Prog = X7A15T-Prog.SchDoc (file not in this document): VCCO0, VCCO14

### Ports
DRV[103..1] (out), FUN (in), nRST (in), SPI (harness SPI)

### Harnesses
SPI: MISO, MOSI, SCLK, ~{CS0}, ~{CS1}, ~{CS2}, ~{CS3}, ~{CS4}, ~{CS5}, ~{CS6}, ~{CS7}, ~{CS8}, ~{CS9}, ~{CS10}

### Nets
1V0: sheet X7A15T-Power/VCCINT, sheet X7A15T-Power/VCCBRAM
1V8: C9.1 L1.1 ; sheet X7A15T-Power/VCCAUX
1V8A: C10.1 L1.2 ; sheet X7A15T-Power/VCCADC
3V3: R186.1 ; sheet X7A15T-Prog/VCCO0, sheet X7A15T-Prog/VCCO14, sheet X7A15T-Fabric/VCCO0, sheet X7A15T-Power/VCCO0, sheet X7A15T-Power/VCCO14, sheet X7A15T-Power/VCCO35, sheet X7A15T-Power/VCCO16, sheet X7A15T-Power/VCCO34, sheet X7A15T-Power/VCCO15
GND: C9.2 C10.2 ; sheet X7A15T-Power/VCCBAT
~{CS1}: sheet X7A15T-Fabric/~{CS}, port SPI.~{CS1}
FUN: port FUN, sheet X7A15T-Fabric/FUN
MISO: sheet X7A15T-Fabric/MISO, port SPI.MISO
MOSI: sheet X7A15T-Fabric/MOSI, port SPI.MOSI
nRST: R186.2 ; port nRST, sheet X7A15T-Fabric/nRST
SCLK: sheet X7A15T-Fabric/SCLK, port SPI.SCLK

### Buses and harness runs
bus DRV[103..1] = port DRV[103..1] = sheet X7A15T-Fabric/DRV[103..1]

### Notes on the sheet
- Chip Select | Target
  ------------+--------------------------
  CS0         | ADC
  CS1         | Mother Board Relay Driver
  CS2         | Relay Extention #1
  CS3         | Relay Extention #2
  CS4         | Relay Extention #3
  CS5         | Relay Extention #4
  CS6         | Relay Extention #5
  CS7         | Relay Extention #6
  CS8         | Relay Extention #7
  CS9         | Relay Extention #8
  CS10        | Relay Extention #9
- designed by
- reviewed by
- last drawn by
- Project:
- Schematic:
- last printed
- DIN-A4 P
- sheets
- of
- File:
- (in symbol C) .

### Library data of the parts
AOI1-AOI4 = Fiducial: Assembly AOI; 13. Created Date/Name: AUG2018/Hören; 01. Distributor: N/A; 02. Distributor Part Number: N/A; 03. Unit Price: N/A; 04. Manufacturer: N/A; 05. Quantity: N/A; 06. Data Sheet: N/A; 07. Manufacturer  Part Number: N/A; 08. Inhouse Stock: N/A; 09. Operating Temperature: N/A; 10. Weight: N/A; 11. RoHS: N/A; 12.UL94 Flammability: N/A; ComponentLink1Description: Info; ComponentLink2Description: Info
C9 C10 = C: CAP CER 10UF 10V X7R 0805; 04. Manufacturer: Samsung Electro-Mechanics; 07. Manufacturer  Part Number: CL21B106KPQNNNE; Tolerance: ±10%; 03. Unit Price: 0.24; 13. Created Date/Name: AUG2018/Hören; Voltage Rating: 10V; Type: X7R; ComponentLink1Description: Info; ComponentLink1URL: https://www.digikey.de/products/en?keywords=1276-1764-6-ND; 02. Distributor Part Number: 1276-1764-6-ND; 09. Operating Temperature: -55°C ~ 125°C; 11. RoHS: YES; 01. Distributor: DigiKey; ComponentLink2Description: DataSheet; Package: 0805
L1 = FB: FERRITE BEAD 600 OHM 0805 1LN; 04. Manufacturer: Würth Elektronik; 07. Manufacturer  Part Number: 742792040; DCR: 150mΩ; Impedance Tolerance: %; 03. Unit Price: 0.22; 13. Created Date/Name: AUG2018/Hören; IRMS: 2A; ComponentLink1Description: Info; ComponentLink1URL: https://www.digikey.de/products/en?keywords=732-1620-6-ND; ComponentLink2Description: DataSheet; ComponentLink2URL: https://www.we-online.de/katalog/datasheet/742792040.pdf; 02. Distributor Part Number: 732-1620-6-ND; 09. Operating Temperature: -55°C ~ 125°C; 11. RoHS: YES; 01. Distributor: DigiKey; ISAT: *; Package: 0805; Tolerance: *; Value: *
R186 = R: as R95 on sheet PSU2; Tolerance: ±1%; ComponentLink1URL: https://www.digikey.de/products/en?keywords=311-10.0KLRDKR-ND; ComponentLink1Description: Info; 02. Distributor Part Number: 311-10.0KLRDKR-ND; 09. Operating Temperature: -55°C ~ 155°C; 11. RoHS: YES; 01. Distributor: DigiKey; ComponentLink2Description: DataSheet; Type: Thick Film; Package: 0402

## Sheet RelayExtension.SchDoc: PCB-Tester Relay Extension
size A4; Date: JUN 2020; CheckedBy: Moerz, Hoeren; Author: Rudziński; CompanyName: TDK-Micronas GmbH; DrawnBy: Rudziński; Engineer: Rudziński; Organization: Test Engineering; Address1: Hans-Bunte-Strasse 19; Address2: D-79108 Freiburg; Address3: Germany; DocumentNumber: U33110; Revision: V1.0; SheetNumber: 19; SheetTotal: 20; DateDraw: JUN 2020; DateChecked: 2020-06-19; Workspace: Workspace; TitleTyp: Title-Typ; PageSetup: Record=PageOptions|CenterHorizontal=True|CenterVertical=True|PrintScale=0.97|XCorrection=1.00|YCorrection=1.00|PrintKind=0|BorderSize=5000000|LeftOffset=0|BottomOffset=0|Orientation=2|PaperLength=1000|PaperWidth=1000|Scale=100|PaperSource=7|PrintQuality=-3|MediaType=1|DitherType=10|PrintScaleMode=1|PaperKind=A4|PaperIndex=9
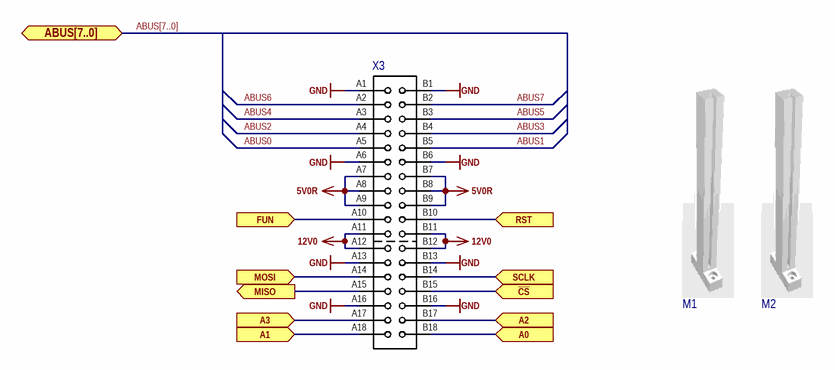
[diagram p6: RelayExtension.SchDoc]

### Parts
M1  PCB Support  [PCB Tester Support]  (value not drawn)
M2  PCB Support  [PCB Tester Support]  (value not drawn)
X3  X  [PCIE-036-02-F-D-TH]  (value not drawn)

### Ports
A0 (in), A1 (in), A2 (in), A3 (in), ABUS[7..0] (bidir), FUN (in), MISO (out), MOSI (in), RST (in), SCLK (in), ~{CS} (in)

### Nets
5V0R: X3.A7 X3.A8 X3.A9 X3.B7 X3.B8 X3.B9
12V0: X3.A11 X3.A12 X3.B11 X3.B12
GND: X3.A1 X3.A6 X3.A13 X3.A16 X3.B1 X3.B6 X3.B13 X3.B16
~{CS}: X3.B15 ; port ~{CS}
A0: X3.B18 ; port A0
A1: X3.A18 ; port A1
A2: X3.B17 ; port A2
A3: X3.A17 ; port A3
ABUS0: X3.A5  [project net ABUS0_19]
ABUS1: X3.B5  [project net ABUS1_19]
ABUS2: X3.A4  [project net ABUS2_19]
ABUS3: X3.B4  [project net ABUS3_19]
ABUS4: X3.A3  [project net ABUS4_19]
ABUS5: X3.B3  [project net ABUS5_19]
ABUS6: X3.A2  [project net ABUS6_19]
ABUS7: X3.B2  [project net ABUS7_19]
FUN: X3.A10 ; port FUN
MISO: X3.A15 ; port MISO
MOSI: X3.A14 ; port MOSI
RST: X3.B10 ; port RST
SCLK: X3.B14 ; port SCLK

### Buses and harness runs
bus ABUS[7..0] = port ABUS[7..0]

### Notes on the sheet
- designed by
- reviewed by
- last drawn by
- Project:
- Schematic:
- last printed
- DIN-A4 L
- sheets
- of
- File:

### Library data of the parts
M1 M2 = PCB Tester Support: 04. Manufacturer: Likom; 07. Manufacturer  Part Number: TBD; 03. Unit Price: 15.0; 13. Created Date/Name: ??? / Hören; System: Connector; 01. Distributor: N/A; 02. Distributor Part Number: N/A; ComponentLink1Description: Info; ComponentLink2Description: DataSheet
X3 = PCIE-036-02-F-D-TH: CONN PCI EXP FMALE 36POS 0.039; 04. Manufacturer: Samtec Inc.; 03. Unit Price: 1.76; 13. Created Date/Name: ??? / Hören; System: Connector; 01. Distributor: DigiKey; 02. Distributor Part Number: SAM10625-ND; 07. Manufacturer  Part Number: PCIE-036-02-F-D-TH; ComponentLink1Description: Info; ComponentLink1URL: https://www.digikey.de/products/en?keywords=PCIE-036-02-F-D-TH; ComponentLink2Description: DataSheet; ComponentLink2URL: http://suddendocs.samtec.com/catalog_english/pcie.pdf